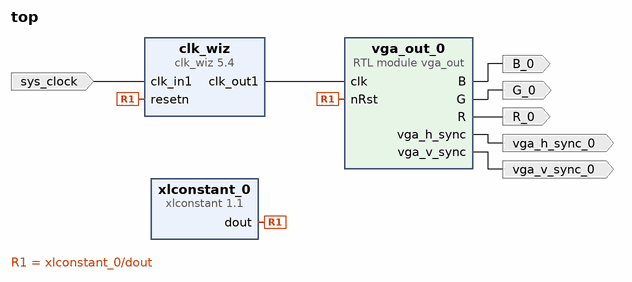
[diagram p0: block diagram of the top level]
# Vivado block design top, xc7z010clg400-1, Vivado 2017.4
create_bd_design top

create_bd_port -dir I -type clk sys_clock
set_property -dict {CONFIG.FREQ_HZ 125000000 CONFIG.PHASE 0.000} [get_bd_ports sys_clock]
create_bd_port -dir O B_0
create_bd_port -dir O G_0
create_bd_port -dir O R_0
create_bd_port -dir O vga_h_sync_0
create_bd_port -dir O vga_v_sync_0

create_bd_cell -type module -reference vga_out vga_out_0
create_bd_cell -type ip -vlnv xilinx.com:ip:clk_wiz:5.4 clk_wiz
set_property -dict [list \
  CONFIG.CLKOUT1_REQUESTED_OUT_FREQ 25 \
  CONFIG.RESET_PORT resetn \
  CONFIG.MMCM_DIVCLK_DIVIDE 5 \
  CONFIG.MMCM_CLKFBOUT_MULT_F 36.500 \
  CONFIG.MMCM_CLKOUT0_DIVIDE_F 36.500 \
  CONFIG.RESET_TYPE ACTIVE_LOW \
  CONFIG.USE_BOARD_FLOW true \
  CONFIG.CLK_IN1_BOARD_INTERFACE sys_clock \
  CONFIG.CLKOUT1_JITTER 312.659 \
  CONFIG.CLKOUT1_PHASE_ERROR 245.713 \
] [get_bd_cells clk_wiz]
create_bd_cell -type ip -vlnv xilinx.com:ip:xlconstant:1.1 xlconstant_0

# ---- connections ----

connect_bd_net [get_bd_pins clk_wiz/clk_out1] [get_bd_pins vga_out_0/clk]
connect_bd_net [get_bd_ports sys_clock] [get_bd_pins clk_wiz/clk_in1]
connect_bd_net [get_bd_pins vga_out_0/B] [get_bd_ports B_0]
connect_bd_net [get_bd_pins vga_out_0/G] [get_bd_ports G_0]
connect_bd_net [get_bd_pins vga_out_0/R] [get_bd_ports R_0]
connect_bd_net [get_bd_pins vga_out_0/vga_h_sync] [get_bd_ports vga_h_sync_0]
connect_bd_net [get_bd_pins vga_out_0/vga_v_sync] [get_bd_ports vga_v_sync_0]
connect_bd_net -net nRst_1 [get_bd_pins xlconstant_0/dout] [get_bd_pins vga_out_0/nRst] [get_bd_pins clk_wiz/resetn]

validate_bd_design
save_bd_design
